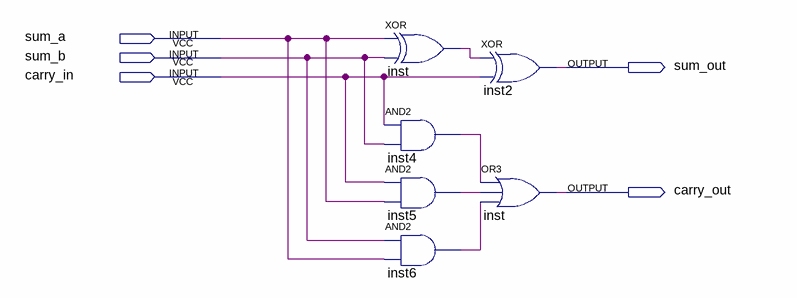
[diagram p0: schematic sheet]
// Quartus schematic full_bit_adder.bdf as structural Verilog: 6 symbols, 5 pins
module full_bit_adder (
  input  sum_a,
  input  sum_b,
  input  carry_in,
  output sum_out,
  output carry_out
);

  wire inst4_out, inst5_out, inst6_out, inst_out;

  xor inst (inst_out, sum_a, sum_b);
  and inst4 (inst4_out, carry_in, sum_b);
  and inst5 (inst5_out, carry_in, sum_a);
  and inst6 (inst6_out, sum_b, sum_a);
  xor inst2 (sum_out, inst_out, carry_in);
  or inst_dup2 (carry_out, inst4_out, inst5_out, inst6_out);
endmodule
